# EAGLE design EnsembleTwo (EAGLE 7.6.0)
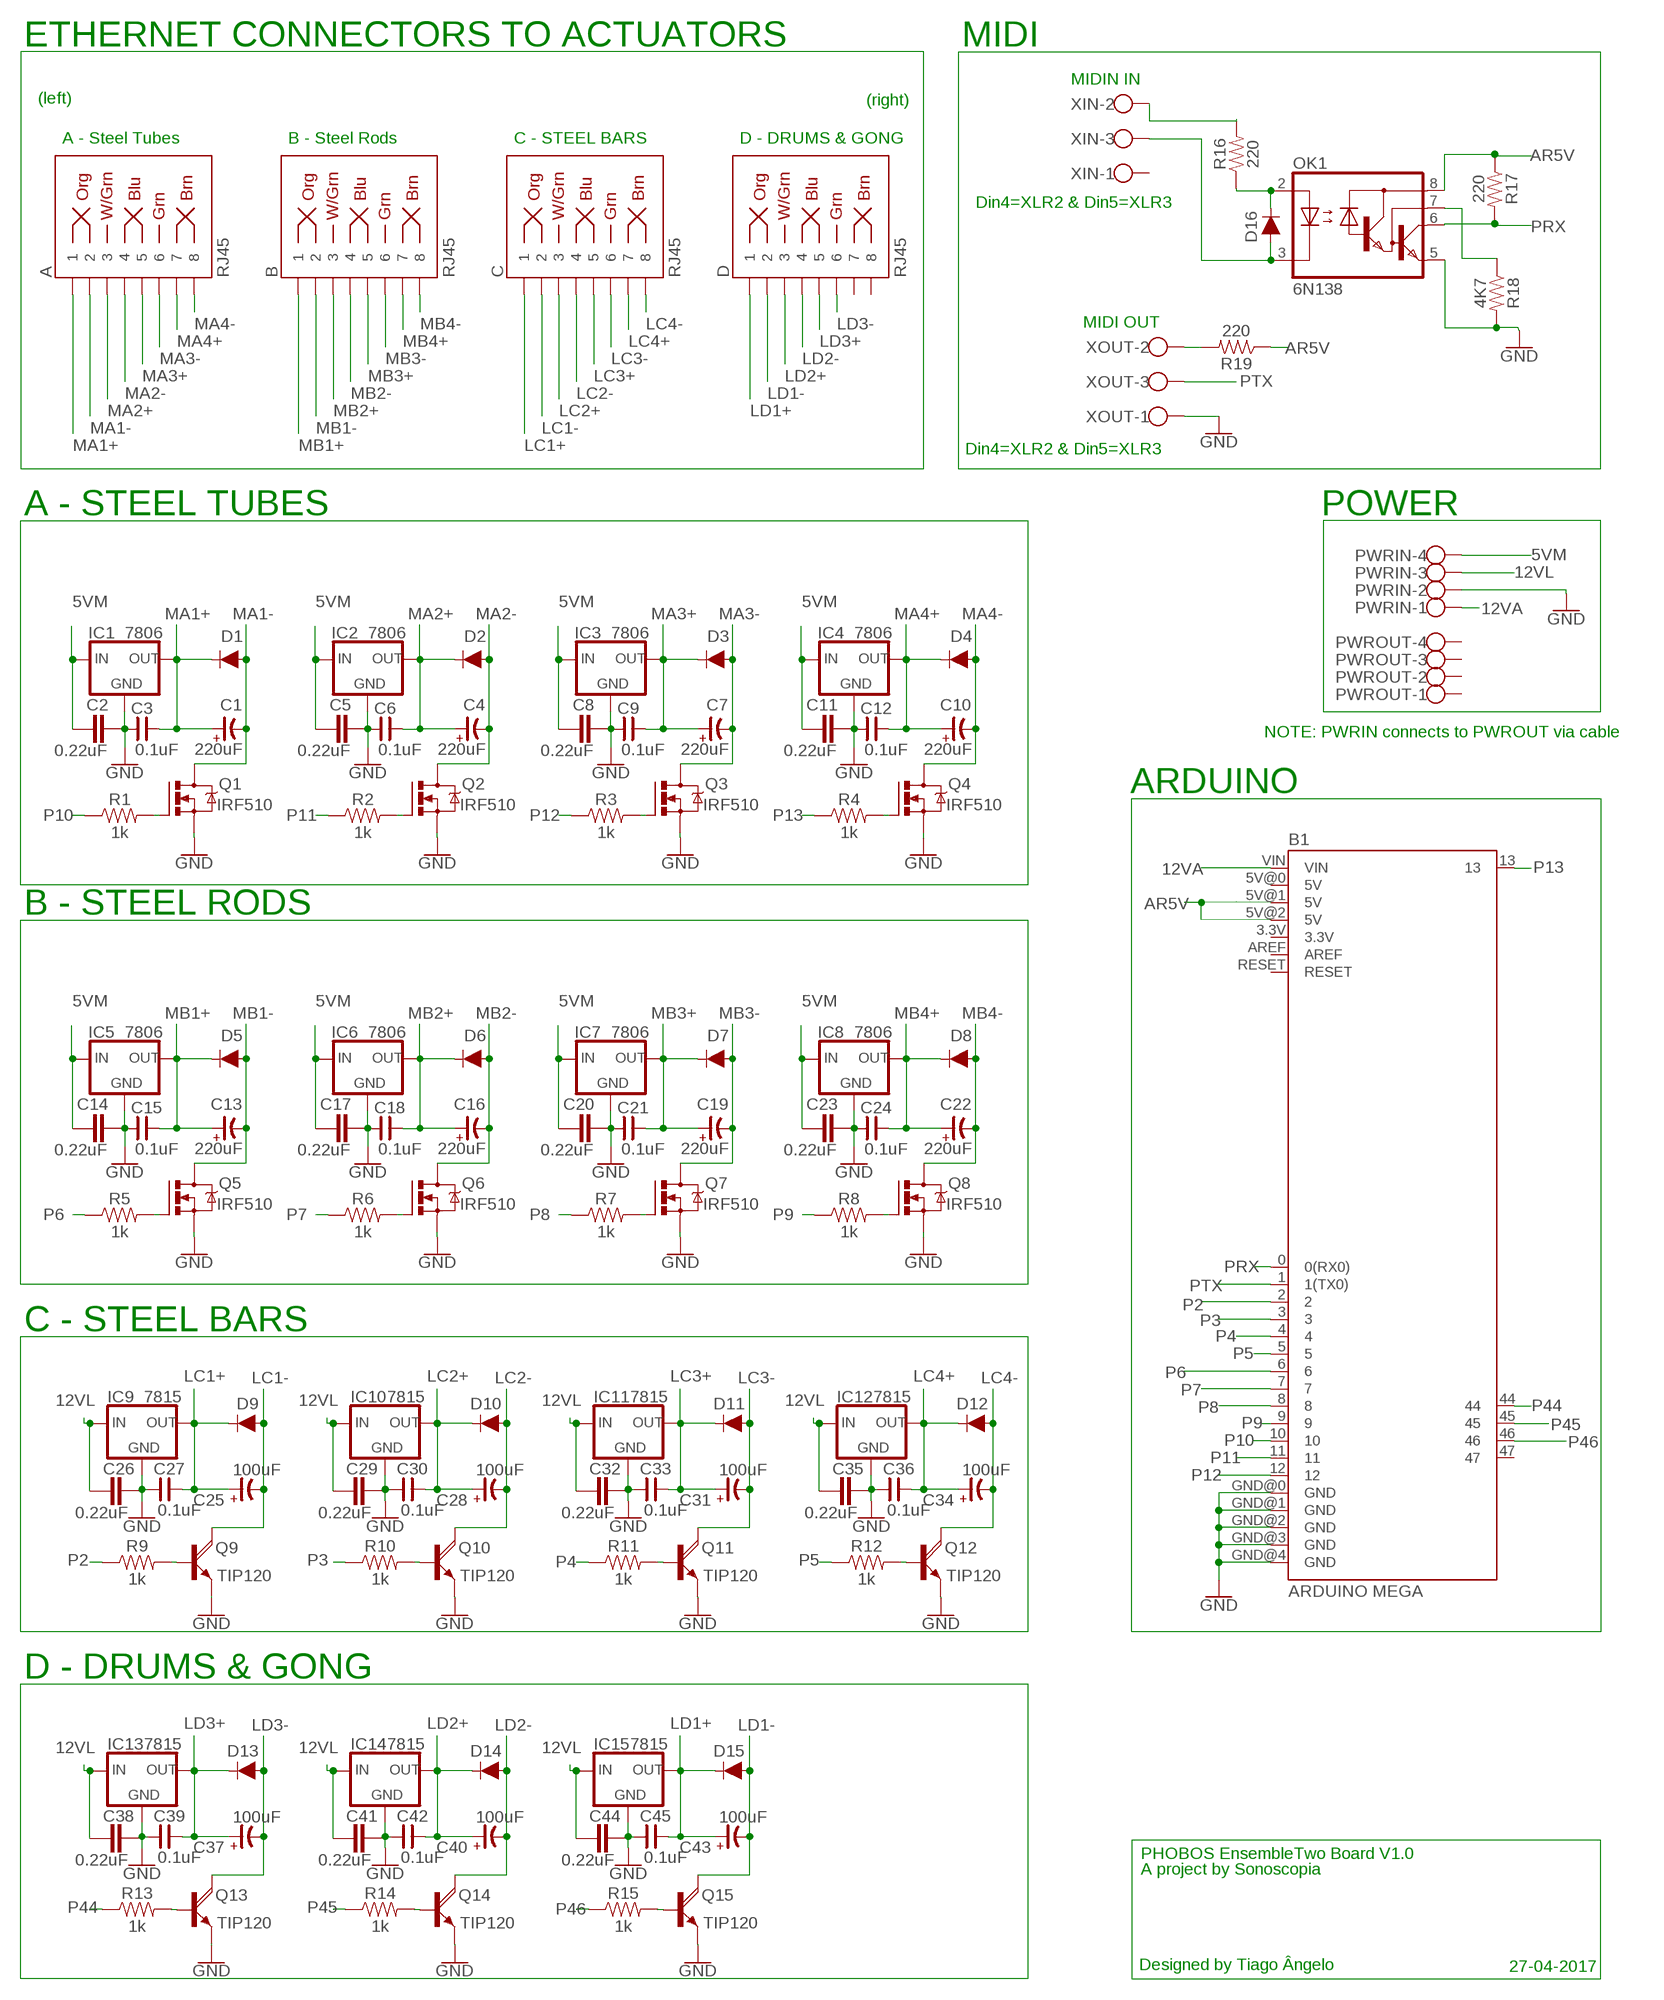
[diagram p0: schematic, sheet 1]

## Parts
A  RJ45  RJ45-8  [RJ45-8]
B  RJ45  RJ45-8  [RJ45-8]
B1  ARDUINO MEGA  ARDUINO_MEGA_R3FULL  [ARDUINO_MEGA]
C  RJ45  RJ45-8  [RJ45-8]
C1  220uF  CP-E-035X080  [E-035X080]
C2  0.22uF  C5/3  [C5B3]
C3  0.1uF  CNP-C025-050X025  [C025-050X025]
C4  220uF  CP-E-035X080  [E-035X080]
C5  0.22uF  C5/3  [C5B3]
C6  0.1uF  CNP-C025-050X025  [C025-050X025]
C7  220uF  CP-E-035X080  [E-035X080]
C8  0.22uF  C5/3  [C5B3]
C9  0.1uF  CNP-C025-050X025  [C025-050X025]
C10  220uF  CP-E-035X080  [E-035X080]
C11  0.22uF  C5/3  [C5B3]
C12  0.1uF  CNP-C025-050X025  [C025-050X025]
C13  220uF  CP-E-035X080  [E-035X080]
C14  0.22uF  C5/3  [C5B3]
C15  0.1uF  CNP-C025-050X025  [C025-050X025]
C16  220uF  CP-E-035X080  [E-035X080]
C17  0.22uF  C5/3  [C5B3]
C18  0.1uF  CNP-C025-050X025  [C025-050X025]
C19  220uF  CP-E-035X080  [E-035X080]
C20  0.22uF  C5/3  [C5B3]
C21  0.1uF  CNP-C025-050X025  [C025-050X025]
C22  220uF  CP-E-035X080  [E-035X080]
C23  0.22uF  C5/3  [C5B3]
C24  0.1uF  CNP-C025-050X025  [C025-050X025]
C25  100uF  CP-E-020X050  [E-020X050]
C26  0.22uF  C5/3  [C5B3]
C27  0.1uF  CNP-C025-050X025  [C025-050X025]
C28  100uF  CP-E-020X050  [E-020X050]
C29  0.22uF  C5/3  [C5B3]
C30  0.1uF  CNP-C025-050X025  [C025-050X025]
C31  100uF  CP-E-020X050  [E-020X050]
C32  0.22uF  C5/3  [C5B3]
C33  0.1uF  CNP-C025-050X025  [C025-050X025]
C34  100uF  CP-E-020X050  [E-020X050]
C35  0.22uF  C5/3  [C5B3]
C36  0.1uF  CNP-C025-050X025  [C025-050X025]
C37  100uF  CP-E-020X050  [E-020X050]
C38  0.22uF  C5/3  [C5B3]
C39  0.1uF  CNP-C025-050X025  [C025-050X025]
C40  100uF  CP-E-020X050  [E-020X050]
C41  0.22uF  C5/3  [C5B3]
C42  0.1uF  CNP-C025-050X025  [C025-050X025]
C43  100uF  CP-E-020X050  [E-020X050]
C44  0.22uF  C5/3  [C5B3]
C45  0.1uF  CNP-C025-050X025  [C025-050X025]
D  RJ45  RJ45-8  [RJ45-8]
D1  1A/50V/1.1V  DIODE-KIT2  [DIODE-1N4001-KIT]
D2  1A/50V/1.1V  DIODE-KIT2  [DIODE-1N4001-KIT]
D3  1A/50V/1.1V  DIODE-KIT2  [DIODE-1N4001-KIT]
D4  1A/50V/1.1V  DIODE-KIT2  [DIODE-1N4001-KIT]
D5  1A/50V/1.1V  DIODE-KIT2  [DIODE-1N4001-KIT]
D6  1A/50V/1.1V  DIODE-KIT2  [DIODE-1N4001-KIT]
D7  1A/50V/1.1V  DIODE-KIT2  [DIODE-1N4001-KIT]
D8  1A/50V/1.1V  DIODE-KIT2  [DIODE-1N4001-KIT]
D9  1A/50V/1.1V  DIODE-KIT2  [DIODE-1N4001-KIT]
D10  1A/50V/1.1V  DIODE-KIT2  [DIODE-1N4001-KIT]
D11  1A/50V/1.1V  DIODE-KIT2  [DIODE-1N4001-KIT]
D12  1A/50V/1.1V  DIODE-KIT2  [DIODE-1N4001-KIT]
D13  1A/50V/1.1V  DIODE-KIT2  [DIODE-1N4001-KIT]
D14  1A/50V/1.1V  DIODE-KIT2  [DIODE-1N4001-KIT]
D15  1A/50V/1.1V  DIODE-KIT2  [DIODE-1N4001-KIT]
D16  200mA/100V/1V  DIODE-1N4148  [DIODE-1N4148]
IC1  7806  78XXS  [78XXS]
IC2  7806  78XXS  [78XXS]
IC3  7806  78XXS  [78XXS]
IC4  7806  78XXS  [78XXS]
IC5  7806  78XXS  [78XXS]
IC6  7806  78XXS  [78XXS]
IC7  7806  78XXS  [78XXS]
IC8  7806  78XXS  [78XXS]
IC9  7815  78XXS  [78XXS]
IC10  7815  78XXS  [78XXS]
IC11  7815  78XXS  [78XXS]
IC12  7815  78XXS  [78XXS]
IC13  7815  78XXS  [78XXS]
IC14  7815  78XXS  [78XXS]
IC15  7815  78XXS  [78XXS]
OK1  6N138  [DIL08]
PWRIN  W237-4  [W237-4]
PWROUT  W237-4  [W237-4]
Q1  IRF510  IRF520  [TO220BV]
Q2  IRF510  IRF520  [TO220BV]
Q3  IRF510  IRF520  [TO220BV]
Q4  IRF510  IRF520  [TO220BV]
Q5  IRF510  IRF520  [TO220BV]
Q6  IRF510  IRF520  [TO220BV]
Q7  IRF510  IRF520  [TO220BV]
Q8  IRF510  IRF520  [TO220BV]
Q9  TIP120  TIP120V  [TO220AV]
Q10  TIP120  TIP120V  [TO220AV]
Q11  TIP120  TIP120V  [TO220AV]
Q12  TIP120  TIP120V  [TO220AV]
Q13  TIP120  TIP120V  [TO220AV]
Q14  TIP120  TIP120V  [TO220AV]
Q15  TIP120  TIP120V  [TO220AV]
R1  1k  1KOHM-VERT-1/4W-1%  [AXIAL-0.1]
R2  1k  1KOHM-VERT-1/4W-1%  [AXIAL-0.1]
R3  1k  1KOHM-VERT-1/4W-1%  [AXIAL-0.1]
R4  1k  1KOHM-VERT-1/4W-1%  [AXIAL-0.1]
R5  1k  1KOHM-VERT-1/4W-1%  [AXIAL-0.1]
R6  1k  1KOHM-VERT-1/4W-1%  [AXIAL-0.1]
R7  1k  1KOHM-VERT-1/4W-1%  [AXIAL-0.1]
R8  1k  1KOHM-VERT-1/4W-1%  [AXIAL-0.1]
R9  1k  1KOHM-VERT-1/4W-1%  [AXIAL-0.1]
R10  1k  1KOHM-VERT-1/4W-1%  [AXIAL-0.1]
R11  1k  1KOHM-VERT-1/4W-1%  [AXIAL-0.1]
R12  1k  1KOHM-VERT-1/4W-1%  [AXIAL-0.1]
R13  1k  1KOHM-VERT-1/4W-1%  [AXIAL-0.1]
R14  1k  1KOHM-VERT-1/4W-1%  [AXIAL-0.1]
R15  1k  1KOHM-VERT-1/4W-1%  [AXIAL-0.1]
R16  220  1KOHM-HORIZ-1/4W-5%  [AXIAL-0.3]
R17  220  1KOHM-HORIZ-1/4W-5%  [AXIAL-0.3]
R18  4K7  1KOHM-HORIZ-1/4W-5%  [AXIAL-0.3]
R19  220  1KOHM-HORIZ-1/4W-5%  [AXIAL-0.3]
XIN  W237-103  [W237-103]
XOUT  W237-103  [W237-103]

## Nets
5VM [5VM]: C2.1 C5.1 C8.1 C11.1 C14.1 C17.1 C20.1 C23.1 IC1.IN IC2.IN IC3.IN IC4.IN IC5.IN IC6.IN IC7.IN IC8.IN PWRIN.4
12VA [12VA]: B1.VIN PWRIN.1
12VL [12VL]: C26.1 C29.1 C32.1 C35.1 C38.1 C41.1 C44.1 IC9.IN IC10.IN IC11.IN IC12.IN IC13.IN IC14.IN IC15.IN PWRIN.3
AR5V: B1.5V@1(5V) B1.5V@2(5V) OK1.8(VCC) R17.P$1 R19.P$1
GND [GND]: B1.GND@0(GND) B1.GND@1(GND) B1.GND@2(GND) B1.GND@3(GND) B1.GND@4(GND) C2.2 C3.1 C5.2 C6.1 C8.2 C9.1 C11.2 C12.1 C14.2 C15.1 C17.2 C18.1 C20.2 C21.1 C23.2 C24.1 C26.2 C27.1 C29.2 C30.1 C32.2 C33.1 C35.2 C36.1 C38.2 C39.1 C41.2 C42.1 C44.2 C45.1 IC1.GND IC2.GND IC3.GND IC4.GND IC5.GND IC6.GND IC7.GND IC8.GND IC9.GND IC10.GND IC11.GND IC12.GND IC13.GND IC14.GND IC15.GND OK1.5(GND) PWRIN.2 Q1.S Q2.S Q3.S Q4.S Q5.S Q6.S Q7.S Q8.S Q9.E Q10.E Q11.E Q12.E Q13.E Q14.E Q15.E R18.P$2 XOUT.1
LC1+: C25.+ C27.2 C.1 D9.C IC9.OUT
LC1-: C25.- C.2 D9.A Q9.C
LC2+: C28.+ C30.2 C.3 D10.C IC10.OUT
LC2-: C28.- C.4 D10.A Q10.C
LC3+: C31.+ C33.2 C.5 D11.C IC11.OUT
LC3-: C31.- C.6 D11.A Q11.C
LC4+: C34.+ C36.2 C.7 D12.C IC12.OUT
LC4-: C34.- C.8 D12.A Q12.C
LD1+: C43.+ C45.2 D15.C D.1 IC15.OUT
LD1-: C43.- D15.A D.2 Q15.C
LD2+: C40.+ C42.2 D14.C D.3 IC14.OUT
LD2-: C40.- D14.A D.4 Q14.C
LD3+: C37.+ C39.2 D13.C D.5 IC13.OUT
LD3-: C37.- D13.A D.6 Q13.C
MA1+: A.1 C1.+ C3.2 D1.C IC1.OUT
MA1-: A.2 C1.- D1.A Q1.D
MA2+: A.3 C4.+ C6.2 D2.C IC2.OUT
MA2-: A.4 C4.- D2.A Q2.D
MA3+: A.5 C7.+ C9.2 D3.C IC3.OUT
MA3-: A.6 C7.- D3.A Q3.D
MA4+: A.7 C10.+ C12.2 D4.C IC4.OUT
MA4-: A.8 C10.- D4.A Q4.D
MB1+: B.1 C13.+ C15.2 D5.C IC5.OUT
MB1-: B.2 C13.- D5.A Q5.D
MB2+: B.3 C16.+ C18.2 D6.C IC6.OUT
MB2-: B.4 C16.- D6.A Q6.D
MB3+: B.5 C19.+ C21.2 D7.C IC7.OUT
MB3-: B.6 C19.- D7.A Q7.D
MB4+: B.7 C22.+ C24.2 D8.C IC8.OUT
MB4-: B.8 C22.- D8.A Q8.D
N$1: Q1.G R1.P$2
N$2: R19.P$2 XOUT.2
N$3: Q2.G R2.P$2
N$4: Q10.B R10.P$2
N$5: Q11.B R11.P$2
N$9: Q9.B R9.P$2
N$14: Q3.G R3.P$2
N$15: Q4.G R4.P$2
N$16: Q5.G R5.P$2
N$18: Q6.G R6.P$2
N$19: Q7.G R7.P$2
N$20: Q8.G R8.P$2
N$21: Q12.B R12.P$2
N$22: Q13.B R13.P$2
N$24: Q14.B R14.P$2
N$25: D16.A OK1.3(C) XIN.3
N$26: D16.C OK1.2(A) R16.P$1
N$27: R16.P$2 XIN.2
N$28: Q15.B R15.P$2
N$29: OK1.7(VB) R18.P$1
P2: B1.2 R9.P$1
P3: B1.3 R10.P$1
P4: B1.4 R11.P$1
P5: B1.5 R12.P$1
P6: B1.6 R5.P$1
P7: B1.7 R6.P$1
P8: B1.8 R7.P$1
P9: B1.9 R8.P$1
P10: B1.10 R1.P$1
P11: B1.11 R2.P$1
P12: B1.12 R3.P$1
P13: B1.13 R4.P$1
P44: B1.44 R13.P$1
P45: B1.45 R14.P$1
P46: B1.46 R15.P$1
PRX: B1.0(0(RX0)) OK1.6(VO) R17.P$2
PTX: B1.1(1(TX0)) XOUT.3
Unconnected: B1.3.3V B1.5V@0(5V) B1.47 B1.AREF B1.RESET D.7 D.8 PWROUT.1 PWROUT.2 PWROUT.3 PWROUT.4 XIN.1

## Notes on the sheet
- ETHERNET CONNECTORS TO ACTUATORS | MIDI
- MIDIN IN
- (left) | (right)
- A - Steel Tubes | B - Steel Rods | C - STEEL BARS | D - DRUMS & GONG
- Din4=XLR2 & Din5=XLR3
- MIDI OUT
- Din4=XLR2 & Din5=XLR3
- A - STEEL TUBES | POWER
- NOTE: PWRIN connects to PWROUT via cable
- ARDUINO
- B - STEEL RODS
- C - STEEL BARS
- D - DRUMS & GONG
- PHOBOS EnsembleTwo Board V1.0
- A project by Sonoscopia
- Designed by Tiago Ângelo | 27-04-2017

## Library data of the parts
A B C D = SparkFun-Connectors:RJ45-8: RJ45 Jack - 8 pin Simple RJ45, 8-pin connection. Commonly used for Cat5, Cat5e, and Cat6 Ethernet cables. Here is the connector we sell at SparkFun: RJ45 8-Pin Connector <https://www.sparkfun.com/products/643> (PRT-00643) Datasheet <https://cdn.sparkfun.com/datasheets/Prototyping/04908.pdf> It is used on this SparkFun product: SparkFun RJ45 Breakout <https://www.sparkfun.com/products/716> (BOB-00716) Note, you may also be interested in the "MAGJACK" version of this. It is basically a RJ45 connector, but also has some status LEDs built into the connector housing. You can check that out in this library at the device named "MAGJACK.dev" and see these products online: RJ45 Ethernet MagJack-Compatible <https://www.sparkfun.com/products/8534> (PRT-08534) SparkFun RJ45 MagJack Breakout <https://www.sparkfun.com/products/13021> (BOB-13021); PROD_ID: CONN-08506; SF_ID: PRT-00643
B1 = PHOBOS-Boards:ARDUINO_MEGA_R3: Arduino Mega R3 ATmega2560 R3 compatible footprint. SparkFun Products: Arduino Mega 2560 R3 <https://www.sparkfun.com/products/11061>
C1 C4 C7 C10 C13 C16 C19 C22 C25 C28 C31 C34 C37 C40 C43 = cap-master:CP-: POLARIZED CAP
C2 C5 C8 C11 C14 C17 C20 C23 C26 C29 C32 C35 C38 C41 C44 = capacitor-wima:C: CAPACITOR naming: grid - package width
C3 C6 C9 C12 C15 C18 C21 C24 C27 C30 C33 C36 C39 C42 C45 = cap-master:CNP-: NON-POLARIZED CAP
D1-D15 = SparkFun-DiscreteSemi:DIODE: Diode These are standard reverse protection diodes and small signal diodes. SparkFun Products: SparkFun SparkPunk Sound Kit <https://www.sparkfun.com/products/11177> SparkFun ESP8266 Thing <https://www.sparkfun.com/products/13231>; PROD_ID: DIO-09176
D16 = SparkFun-DiscreteSemi:DIODE: Diode These are standard reverse protection diodes and small signal diodes. SparkFun Products: SparkFun SparkPunk Sound Kit <https://www.sparkfun.com/products/11177> SparkFun ESP8266 Thing <https://www.sparkfun.com/products/13231>; PROD_ID: DIO-08378
IC1-IC15 = v-reg:78XXS: VOLTAGE REGULATOR
OK1 = optocoupler:6N138: MOTOROLA OPTO COUPLER; MF: VISHAY/TELEFUNKEN; MPN: 6N138; OC_FARNELL: 9860150; OC_NEWARK: 35K5294
PWRIN PWROUT = con-wago-500:W237-4: WAGO SCREW CLAMP; OC_FARNELL: unknown; OC_NEWARK: unknown
Q1-Q8 = transistor-power:IRF520: HEXFET Power MOSFET
Q9-Q15 = rocketfarm:TIP120: NPN DARLINGTON TRANSISTOR
R1-R15 = SparkFun-Resistors:1KOHM: 1kΩ resistor A resistor is a passive two-terminal electrical component that implements electrical resistance as a circuit element. Resistors act to reduce current flow, and, at the same time, act to lower voltage levels within circuits. - Wikipedia; PROD_ID: RES-12182
R16-R19 = SparkFun-Resistors:1KOHM: 1kΩ resistor A resistor is a passive two-terminal electrical component that implements electrical resistance as a circuit element. Resistors act to reduce current flow, and, at the same time, act to lower voltage levels within circuits. - Wikipedia; PROD_ID: RES-08380; VALUE: 1k
XIN XOUT = con-wago-500:W237-103: WAGO SCREW CLAMP; MPN: 237-103; OC_FARNELL: unknown; OC_NEWARK: 18M7116

## Net classes
0 default: width 0.508 mm, drill 0.508 mm, clearance 0.406 mm
1 GND: width 1.016 mm, drill 0.508 mm, clearance 0.508 mm
2 5VM: width 1.016 mm, drill 0.508 mm, clearance 0.508 mm
3 12VL: width 0.61 mm, drill 0.508 mm, clearance 0.508 mm
4 12VA: width 0.508 mm, drill 0.508 mm, clearance 0.508 mm
5 AR5V: width 0.406 mm, drill 0.508 mm, clearance 0.508 mm
6 PTX: width 0.406 mm, drill 0.508 mm, clearance 0.508 mm
7 PRX: width 0.406 mm, drill 0.508 mm, clearance 0.508 mm

## Board
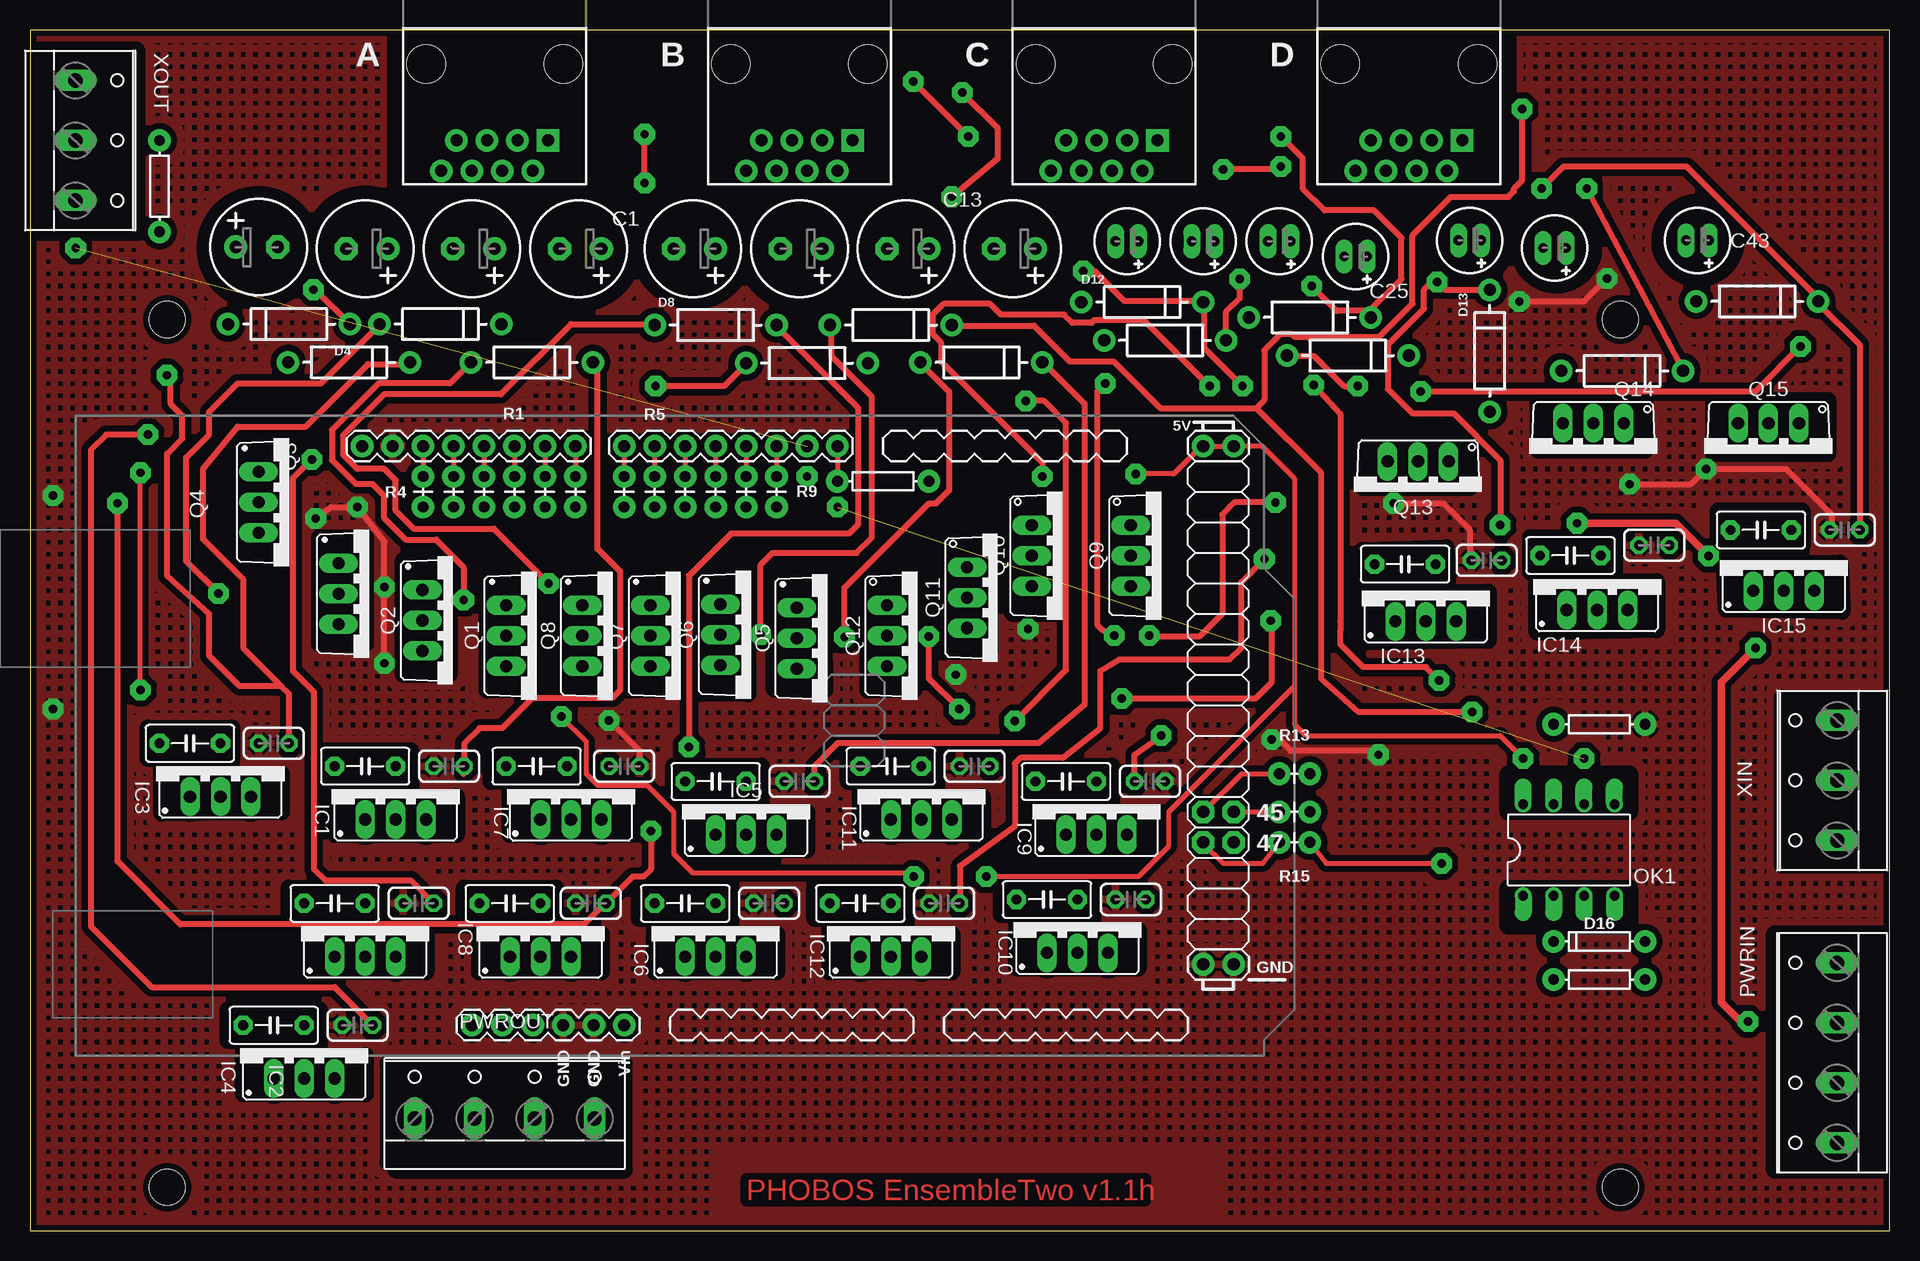
[diagram p1: board, top side]
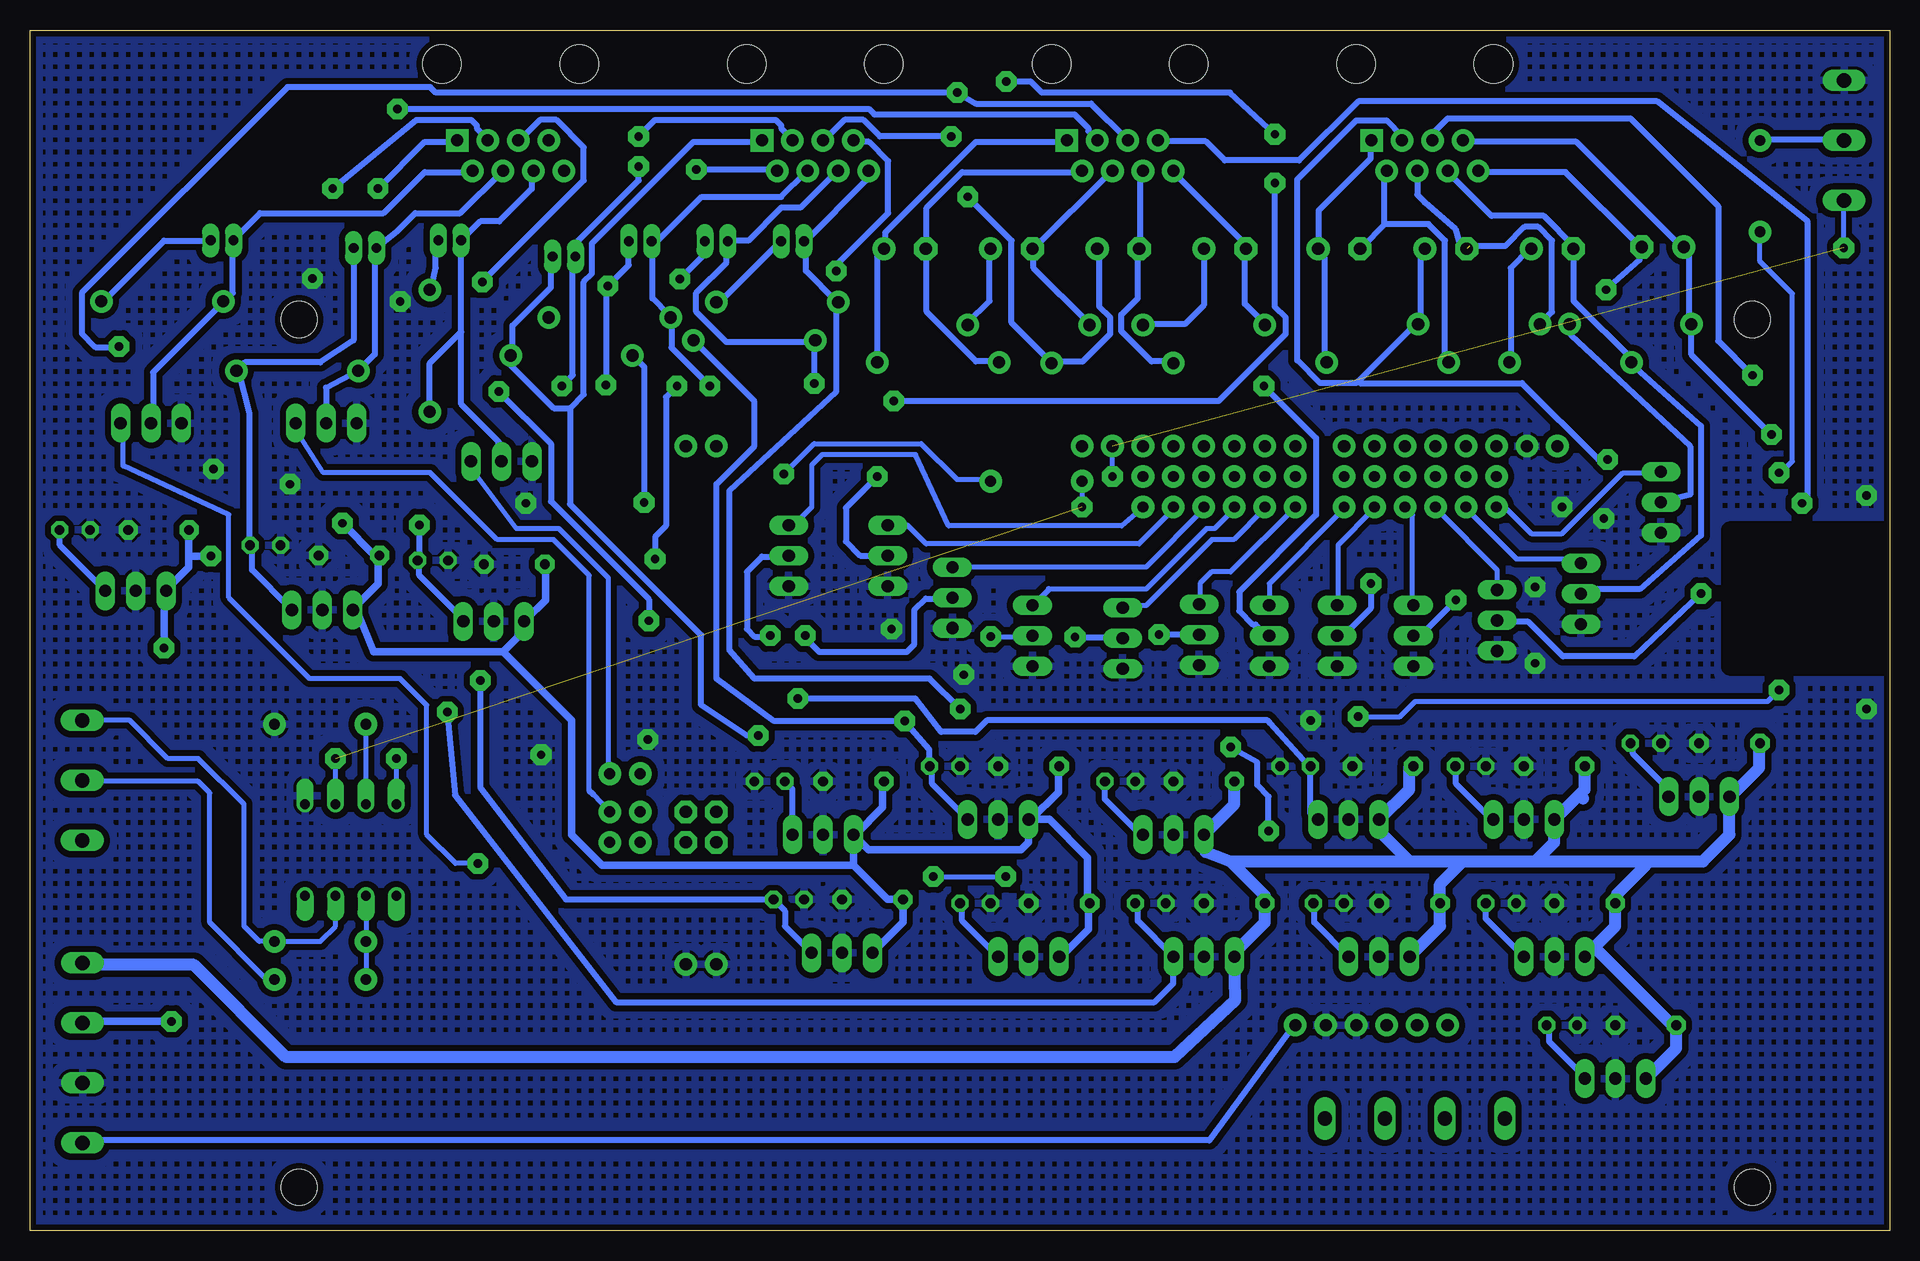
[diagram p2: board, bottom side, seen from below]

Size 155 x 100.08 mm. Coordinates in mm from the lower left corner, seen from the top.
Outline: 0,0 155,0 155,100.08 0,100.08 0,0
Copper layers (1*16): Top 0.035mm / dielectric 1.5mm / Bottom 0.035mm
Design rules "Dek": minimum track width 12mil, minimum drill 36mil, track to track 12mil, track to pad 12mil, pad to pad 12mil, via to via 12mil, smd to smd 0mil, copper to edge 10mil, drill to drill 12mil, minimum pad ring 12mil, minimum via ring 20mil, stop-mask expansion 4mil, vias tented up to drill 25mil, thermal gap 10mil
Holes 3 mm at 132.55,75.95 132.55,3.65 11.45,3.65 11.45,75.95
Holes 1.5 mm at 203.2,95.25
tRestrict: area 30.5,87 to 47,108; area 55.9,87 to 72.4,108; area 81.3,87 to 97.8,108; area 106.7,87 to 123.2,108; area 146.1,30.5 to 154.9,44.5; area 145.4,5.1 to 154.9,24.8; area 29.8,5.1 to 49.5,14; area -0.6,83.2 to 8.9,98.4; area 16.5,15.9 to 24.1,18.4; area 17.8,11.4 to 27.9,14.6; area 21.6,26 to 29.2,28.6; area 22.9,21.6 to 33,24.8; 72 more areas
bRestrict: area -2.5,47 to 13.3,58.4
vRestrict: area 71.1,64.1 to 91.4,66.7; area 96.5,36.2 to 101.6,64.1; area 96.5,23.5 to 101.6,31.1; area 53.3,15.9 to 73.7,18.4; area 76.2,15.9 to 96.5,18.4; area -2.5,47 to 13.3,58.4; area 123.2,29.2 to 133.3,34.3; area 141,76.2 to 147.3,78.7; area 103.5,74.9 to 109.9,77.5; area 106.7,71.8 to 113,74.3; area 91.4,73 to 97.8,75.6; area 89.5,76.2 to 95.9,78.7; 10 more areas

### Footprints (pad centres in the part's own frame; a part is rotated, then mirrored left to right if it is on the bottom)
RJ45-8 = drill 1 pad 1.88 square: 1 -4.445,6.35 | drill 1 pad 1.88: 2 -3.175,8.89; 3 -1.905,6.35; 4 -0.635,8.89; 5 0.635,6.35; 6 1.905,8.89; 7 3.175,6.35; 8 4.445,8.89 | hole 3.2: -5.715,0; 5.715,0
ARDUINO_MEGA = drill 1.016 pad 1.88: 0 13.97,24.13; 1 11.43,24.13; 2 8.89,24.13; 3 6.35,24.13; 3.3V -13.97,-24.13; 4 3.81,24.13; 5 1.27,24.13; 5V@0 -11.43,-24.13; 5V@1 44.45,24.13; 5V@2 46.99,24.13; 6 -1.27,24.13; 7 -3.81,24.13; 8 -7.874,24.13; 9 -10.414,24.13; 10 -12.954,24.13; 11 -15.494,24.13; 12 -18.034,24.13; 13 -20.574,24.13; AREF -25.654,24.13; GND@0 -8.89,-24.13; GND@1 -6.35,-24.13; GND@2 44.45,-19.05; GND@3 46.99,-19.05; GND@4 -23.114,24.13; RESET -16.51,-24.13; VIN -3.81,-24.13 | drill 1.016 pad 1.88 octagon: 44 44.45,-6.35; 45 46.99,-6.35; 46 44.45,-8.89; 47 46.99,-8.89
E-035X080 = drill 1.016 pad 1.93: + -1.905,0 | drill 1.016 pad 1.93 octagon: - 1.587,0
C5B3 = drill 0.813 pad 1.6 octagon: 1 -2.54,0; 2 2.54,0
C025-050X025 = drill 0.813 pad 1.422 octagon: 1 -1.27,0; 2 1.27,0
E-020X050 = drill 0.813 long: + -0.953,0; - 0.953,0
DIODE-1N4001-KIT = drill 1.016 pad 1.88: A -5.08,0; C 5.08,0
DIODE-1N4148 = drill 0.9 pad 1.88: A -3.81,0; C 3.81,0
78XXS = drill 1.016 long: GND 0,-2.54; IN -2.54,-2.54; OUT 2.54,-2.54
DIL08 = drill 0.813 offset: 1 -3.81,-3.81; 2 -1.27,-3.81; 3 1.27,-3.81; 4 3.81,-3.81; 5 3.81,3.81; 6 1.27,3.81; 7 -1.27,3.81; 8 -3.81,3.81
W237-4 = drill 1.194 long: 1 -7.5,-1.27; 2 -2.5,-1.27; 3 2.5,-1.27; 4 7.5,-1.27
TO220BV = drill 1.016 long: D 0,-2.54; G -2.54,-2.54; S 2.54,-2.54
TO220AV = drill 1.016 long: B -2.54,-2.54; C 0,-2.54; E 2.54,-2.54
AXIAL-0.1 = drill 0.9 pad 1.88: P$1 -1.27,0; P$2 1.27,0
AXIAL-0.3 = drill 0.9 pad 1.88: P$1 -3.81,0; P$2 3.81,0
W237-103 = drill 1.194 long: 1 -5,-1.29; 2 0,-1.29; 3 5,-1.29

### Placement (x,y rotation side)
A  38.73,97.23 180 top
B  64.13,97.23 180 top
B1  53.34,41.27 0 top
C  89.53,97.23 180 top
C1  45.72,81.84 180 top
C2  27.94,38.73 0 top
C3  34.92,38.73 0 top
C4  36.83,81.84 180 top
C5  25.4,27.3 0 top
C6  32.38,27.3 0 top
C7  27.94,81.84 180 top
C8  13.34,40.64 0 top
C9  20.32,40.64 0 top
C10  19.05,81.99 0 top
C11  20.32,17.14 0 top
C12  27.3,17.14 0 top
C13  81.91,81.84 180 top
C14  57.15,37.47 0 top
C15  64.13,37.47 0 top
C16  73.03,81.84 180 top
C17  54.61,27.3 0 top
C18  61.6,27.3 0 top
C19  64.13,81.84 180 top
C20  42.23,38.73 0 top
C21  49.53,38.73 180 top
C22  55.24,81.84 180 top
C23  40.01,27.3 0 top
C24  46.75,27.3 0 top
C25  110.49,81.2 180 top
C26  86.36,37.47 0 top
C27  93.34,37.47 180 top
C28  104.14,82.47 180 top
C29  84.77,27.62 0 top
C30  91.76,27.62 0 top
C31  97.79,82.47 180 top
C32  71.75,38.73 0 top
C33  78.74,38.73 0 top
C34  91.44,82.47 180 top
C35  69.22,27.3 0 top
C36  76.2,27.3 0 top
C37  120.02,82.55 180 top
C38  114.62,55.56 0 top
C39  121.42,55.88 0 top
C40  127.08,81.92 180 top
C41  128.41,56.29 0 top
C42  135.39,57.15 0 top
C43  138.99,82.55 180 top
C44  144.28,58.42 0 top
C45  151.27,58.42 0 top
D  114.94,97.23 180 top
D1  41.84,72.39 0 top
D2  34.21,75.56 0 top
D3  26.59,72.39 0 top
D4  21.59,75.56 180 top
D5  79.3,72.39 0 top
D6  71.75,75.49 0 top
D7  64.77,72.31 0 top
D8  57.15,75.49 0 top
D9  109.86,72.95 0 top
D10  106.68,76.12 0 top
D11  94.62,74.22 0 top
D12  92.71,77.39 0 top
D13  121.68,73.34 90 top
D14  132.72,71.68 0 top
D15  143.97,77.47 0 top
D16  130.81,24.13 180 top
IC1  30.48,36.83 0 top
IC2  27.94,25.4 0 top
IC3  15.88,38.73 0 top
IC4  22.86,15.24 0 top
IC5  59.69,35.56 0 top
IC6  57.15,25.4 0 top
IC7  45.09,36.83 0 top
IC8  42.55,25.4 0 top
IC9  88.9,35.56 0 top
IC10  87.31,25.72 0 top
IC11  74.29,36.83 0 top
IC12  71.75,25.4 0 top
IC13  116.34,53.34 0 top
IC14  130.63,54.29 0 top
IC15  146.19,55.88 0 top
OK1  128.27,31.75 0 top
PWRIN  149.35,14.84 90 top
PWROUT  39.57,10.65 0 top
Q1  42.23,49.6 270 top
Q2  35.24,50.88 270 top
Q3  28.26,53.1 270 top
Q4  21.59,60.72 270 top
Q5  66.46,49.4 270 top
Q6  60.08,49.68 270 top
Q7  54.24,49.6 270 top
Q8  48.58,49.6 270 top
Q9  94.3,56.27 270 top
Q10  86.04,56.27 270 top
Q11  80.65,52.78 270 top
Q12  73.98,49.6 270 top
Q13  115.71,61.59 180 top
Q14  130.31,64.77 180 top
Q15  144.92,64.77 180 top
R1  40.39,61.59 270 top
R2  37.85,61.59 270 top
R3  35.31,61.59 270 top
R4  32.77,61.59 270 top
R5  52.07,61.59 270 top
R6  49.53,61.59 270 top
R7  45.47,61.59 270 top
R8  42.93,61.59 270 top
R9  62.23,61.59 270 top
R10  59.69,61.59 270 top
R11  57.15,61.59 270 top
R12  54.61,61.59 270 top
R13  105.41,38.1 0 top
R14  105.41,34.92 0 top
R15  105.41,32.38 0 top
R16  130.81,20.95 0 top
R17  71.12,62.48 180 top
R18  130.81,42.23 0 top
R19  10.79,87.07 90 top
XIN  149.35,37.54 90 top
XOUT  5.08,90.88 270 top

### Tracks (layer width: path | path; a pad name or v marks a point on that pad's centre or on a via)
5VM
  Bottom 1.016: IC7.IN 40.03,36.8 40.03,38.63 C20.1 | C8.1 10.87,40.44 10.87,38.61 13.16,36.32 IC3.IN 13.49,35.72 13.49,35.56 | C2.1 25.4,36.8 25.86,36.34 | 25.86,36.34 27.91,34.29 IC1.IN | PWRIN.4 150.44,22.17 141.33,22.17 133.63,14.48 59.59,14.48 54.52,19.23 IC6.IN 54.45,23.34 52.07,25.72 C17.1 52.07,27.94 54.93,30.8 | 13.49,35.08 13.49,35.56 | 25.56,36.04 25.86,36.34 | IC4.IN 17.78,15.24 C11.1 18.26,17.3 24.61,23.65 | IC2.IN 24.61,23.65 | 24.61,23.65 22.86,25.4 C5.1 22.7,27.78 22.7,28.1 20.32,30.48 20.32,30.8 | IC8.IN 37.46,25.4 C23.1 37.46,28.89 35.56,30.8 | 42.39,33.81 IC7.IN | C14.1 54.61,35.56 IC5.IN 56.99,32.54 56.99,31.59 54.93,30.8 | IC7.IN 42.55,33.34 40.01,30.8 | 28.1,33.18 28.1,33.81 IC1.IN | 54.93,30.8 40.01,30.8 | 40.01,30.8 35.56,30.8 | 35.56,30.8 29.53,30.8 | 29.53,30.8 27.94,32.38 IC1.IN | 29.53,30.8 20.32,30.8 | 20.32,30.8 15.56,30.8 13.34,33.02 13.34,35.4 13.49,35.56
12VA
  Bottom 0.508: PWRIN.1 150.44,7.54 56.69,7.54 49.63,17.14 B1.VIN
12VL  (via drill 0.7)
  Top 0.61: v139.93,56.24 137.19,58.98 v128.96,58.98 | v143.83,48.58 140.97,45.72 140.97,19.05 142.56,17.46 v143.19,17.46
  Bottom 0.61: 141.76,56.24 141.76,55.32 143.59,53.49 IC15.IN 143.83,53.16 v143.83,48.58 | 141.76,56.24 141.76,58.29 C44.1 | 150.67,17.37 PWRIN.3 150.62,17.46 v143.19,17.46 | C38.1 112.04,55.78 112.04,52.58 113.64,50.98 IC13.IN 114.3,50.8 114.3,49.53 115.57,48.26 | IC12.IN 69.06,22.86 66.78,25.15 66.78,27.2 C35.1 66.83,27.46 66.83,31.11 70.01,34.29 IC11.IN | C32.1 69.29,38.63 69.29,36.58 71.58,34.29 IC11.IN | C26.1 83.92,37.36 83.92,35.31 86.21,33.02 IC9.IN | v139.93,56.24 141.76,56.24 | v128.96,58.98 126.21,56.24 C41.1 125.98,56.24 125.98,53.95 128.04,51.89 IC14.IN 127.64,51.44 126.37,48.26 115.57,48.26 | IC10.IN 82.23,25.72 C29.1 83.5,27.62 86.36,30.48 | 86.36,30.48 IC9.IN | IC11.IN 71.75,32.38 72.39,31.75 85.09,31.75 IC9.IN | 115.57,48.26 109.86,42.55 109.86,33.02 107.31,30.48 86.36,30.48
AR5V  (via drill 0.7)
  Top 0.406: v92.15,63.09 95.35,63.09 97.57,65.31 | 97.64,65.38 97.57,65.31 | v124.46,39.37 122.56,41.27 106.36,41.27 105.41,42.23 105.41,45.4 | 105.41,45.4 105.41,62.71 102.71,65.41 B1.5V@2 B1.5V@1 97.63,65.25 97.57,65.31 | v79.69,29.53 92.39,29.53 94.93,32.07 94.93,34.92 105.41,45.4 | v44.29,42.86 46.35,40.8 46.35,38.1 47.31,37.15 51.43,37.15 53.66,34.92 53.66,31.43 55.24,29.84 73.34,29.84 v73.66,29.53 | v9.21,45.09 v9.21,63.18
  Bottom 0.406: v92.15,63.09 89.64,65.61 80.72,65.61 77.75,62.64 75.01,62.64 R17.P$1 | v124.46,39.37 OK1.8 | R19.P$1 10.79,80.8 8.1,78.11 8.1,64.14 9.05,63.18 v9.21,63.18 | v44.29,42.86 40.8,42.86 39.53,44.13 10.16,44.13 v9.21,45.09 | v79.69,29.53 v73.66,29.53
GND  (via drill 0.7)
  Top 0.508: v113.67,60.64 117.79,60.64 120.02,58.42 120.02,56.02 C39.1 | v124.14,77.47 129.54,77.47 v131.44,79.38 | v133.35,62.23 138.43,62.23 v139.7,63.5 146.37,63.5 150.18,59.69 150.18,58.6 C45.1 | C21.1 50.8,40.01 v48.26,42.55 | v112.4,39.69 112.08,40.01 105.09,40.01 104.14,40.96 v103.5,40.96 | v23.81,59.37 25.08,60.33 v27.3,60.33 29.53,57.47 v29.53,53.66 v29.53,47.31
  other vias: 1.91,61.28 1.91,43.5 77.15,46.35 83.19,50.16
  pour Bottom (isolate 0.508, hatched): -5.08,104.14 160.02,104.14 160.02,0 -5.08,0
  pour Top (isolate 0.508, hatched): -3.81,102.87 157.48,102.87 157.48,0 -3.81,0
LC1+  (via drill 0.7)
  Top 0.508: C27.2 92.07,39.69 v94.3,41.27
  Bottom 0.508: C25.+ 111.58,81.15 111.58,78.64 114.78,75.44 114.78,73.15 D9.C 115.01,72.69 115.01,72.24 111.35,68.58 109.98,68.58 | 109.98,68.58 108.84,69.72 108.84,79.1 108.15,79.78 108.15,82.3 99.69,90.75 93.98,90.75 C.1 | 109.98,68.58 109.98,60.58 99.06,49.66 99.06,43.81 95.25,41.27 v94.3,41.27 | IC9.OUT 91.44,36.83 C27.2
LC1-  (via drill 0.7)
  Top 0.508: v110.67,70.41 109.53,70.41 107.01,72.92 104.95,72.92 D9.A | 93.98,49.61 v93.29,49.61 93.37,49.53 97.47,49.53 99.38,51.44 99.38,59.69 100.39,60.71 v103.81,60.71 | v99.47,88.47 104.04,88.47 v104.27,88.7
  Bottom 0.508: v110.67,70.41 109.75,71.32 109.75,81.15 C25.- 109.53,81.38 109.53,82.3 104.27,87.55 v104.27,88.7 | v103.81,60.71 103.81,72.01 104.72,72.92 D9.A | v99.47,88.47 92.84,88.47 C.2 | Q9.C 91.83,56.2 93.98,56.2 95.25,54.93 95.25,50.16 94.62,49.53 93.37,49.53 v93.29,49.61
LC2+  (via drill 0.7)
  Top 0.508: v104.27,91.21 106.1,89.38 106.1,86.87 107.93,85.04 112.04,85.04 114.33,82.75 114.33,79.32 111.58,76.58 D10.C 111.44,76.68 108.9,76.68 v106.84,78.74 | v107,70.48 107.47,70.01 109.22,68.1 109.22,50.8 109.22,50.01 109.22,48.9 111.12,46.99 116.36,46.99 v117.47,45.88
  Bottom 0.508: 89.9,23.18 IC10.OUT 92.07,25.4 92.07,26.67 C30.2 110.33,27.62 117.47,36.99 v117.47,45.88 | v104.27,91.21 102.9,92.58 92.84,92.58 92.38,92.13 92.38,91.9 91.47,90.98 C.3 | C28.+ 105.09,80.49 v106.84,78.74 107,78.58 v107,70.48
LC2-  (via drill 0.7)
  Top 0.508: v84.38,62.87 84.38,64.01 75.92,72.47 75.92,74.07 75.24,74.75 75.24,76.35 76.15,77.27 80.03,77.27 80.95,76.35 86.21,76.35 86.89,75.67 88.49,75.67 88.72,75.89 92.84,75.89 v98.32,70.41
  Bottom 0.508: v98.32,70.41 101.52,73.61 101.52,75.89 D10.A 101.75,76.35 103.12,77.72 103.12,82.3 C28.- 102.9,82.3 99.01,86.18 92.38,86.18 90.32,88.24 C.4 | v84.38,62.87 87,60.25 87,57.47 85.8,56.27 Q10.C
LC3+  (via drill 0.7)
  Top 0.508: v100.84,79.32 100.84,77.72 99.69,76.58 D11.C | v73.63,95.78 v78.21,91.21 | v51.23,87.33 v51.23,91.39 | 83.06,69.22 v83.01,69.16 84.51,69.16 86.36,67.31 86.36,46.75 v82.09,42.48
  Bottom 0.508: v100.84,79.32 98.78,81.38 98.78,82.3 C31.+ | IC11.OUT 79.81,37.26 79.81,38.63 C33.2 80.03,38.86 80.03,40.11 v82.09,42.48 92.96,42.48 97.79,46.04 97.79,62.23 94.62,65.41 94.62,69.14 D11.C 99.69,74.07 | v78.21,91.21 84.15,91.21 85.52,92.58 87.12,92.58 88.72,90.98 C.5 | v73.63,95.78 71.58,95.78 70.66,94.87 54.97,94.87 v51.23,91.39 | v51.23,87.33 51.23,77.04 50.32,76.12 50.32,74.75 55.9,69.16 v83.01,69.16
LC3-  (via drill 0.7)
  Top 0.508: v90.36,49.61 89.41,50.06 88.95,50.52 88.95,69.95 v89.64,70.64
  Bottom 0.508: C.6 87.81,88.24 90.78,85.27 92.38,85.27 95.12,82.53 96.72,82.53 C31.- 96.95,82.3 96.95,80.7 99.47,78.18 99.47,76.58 96.95,74.07 89.87,74.07 D11.A 89.64,74.07 v89.64,70.64 | v90.36,49.61 90.36,49.4 89.22,48.26 81.91,48.26 81.28,48.9 81.28,51.75 80.33,52.7 78.18,52.7 Q11.C
LC4+  (via drill 0.7)
  Top 0.508: v87.81,80.01 88.72,80.01 91.24,77.5 97.64,77.5 D12.C 97.87,77.27 97.87,73.61 v101.07,70.41 | C36.2 77.52,27.43 77.52,30.4 82.09,33.71 82.09,38.96 82.55,39.42 86.09,39.42 89.22,41.91 89.22,46.67 90.81,47.62 100.01,47.62 100.97,48.58 100.97,54.08 v102.9,56.01
  Bottom 0.508: C36.2 77.29,27.2 77.29,25.83 74.32,22.86 IC12.OUT | C34.+ 92.61,82.3 97.64,77.27 D12.C | v87.81,80.01 87.81,80.47 83.46,84.81 83.46,89.15 85.06,90.75 86.21,90.75 C.7 | v102.9,56.01 102.9,57.84 101.98,58.75 101.98,69.49 v101.07,70.41
LC4-  (via drill 0.7)
  Top 0.508: v77.47,43.5 74.93,46.04 v74.93,49.53
  Bottom 0.406: v74.93,49.53 71.51,49.53 Q12.C
  Bottom 0.508: C.8 85.29,88.24 85.29,87.55 90.32,82.53 C34.- 90.32,82.3 90.32,80.01 87.81,77.5 D12.A 87.81,77.27 87.81,69.95 96.71,61.68 96.71,48.45 94.62,46.04 80.01,46.04 v77.47,43.5
LD1+  (via drill 0.7)
  Top 0.508: v125.98,86.87 127.81,88.7 138.1,88.7 148.84,77.95 148.84,77.5 D15.C 149.07,77.27 152.5,73.84 152.5,58.52 C45.2
  Bottom 0.508: C45.2 152.5,58.29 152.5,57.15 148.84,53.49 IC15.OUT | C43.+ 140.16,82.53 143.81,82.53 148.84,77.5 D15.C | v125.98,86.87 122.1,90.75 119.58,90.75 D.1
LD1-
  Bottom 0.508: Q15.C 144.73,67.44 144.73,71.55 139.01,77.27 D15.A 138.79,77.5 138.1,78.18 138.1,82.53 C43.- 137.87,82.75 135.81,84.81 125.53,84.81 122.1,88.24 118.21,88.24 D.2
LD2+  (via drill 0.7)
  Top 0.508: v129.77,86.87 D14.C
  Bottom 0.508: IC14.OUT 133.3,51.89 136.5,55.09 136.5,57.15 C42.2 136.73,57.38 136.73,68.12 137.62,71.55 D14.C 137.09,72.39 130.81,72.39 128.03,74.22 C40.+ | v129.77,86.87 122.78,92.58 118.21,92.58 117.75,92.13 117.75,91.9 116.84,90.98 D.3
LD2-
  Bottom 0.508: Q14.C 130.33,67.44 130.33,70.28 D14.A 126.26,73.05 126.26,81.89 C40.- 124.45,83.25 122.89,84.81 119.13,84.81 115.7,88.24 D.4
LD3+  (via drill 0.7)
  Top 0.508: v122.56,58.83 122.56,64.24 118.67,68.12 115.24,68.12 113.18,70.18 113.18,73.84 116.21,76.86 116.21,78.42 116.88,79.1 v117.3,79.1 117.97,78.42 D13.C
  Bottom 0.508: IC13.OUT 118.9,50.98 122.56,54.63 122.56,55.78 C39.2 122.56,56.01 v122.56,58.83 | C37.+ 121.18,82.53 121.18,80.24 121.51,78.64 D13.C | v117.3,79.1 108.84,87.55 108.84,90.3 111.12,92.58 112.5,92.58 114.1,90.98 D.5
LD3-
  Bottom 0.508: D.6 113.18,88.24 113.18,86.84 115.89,84.14 117.47,84.14 C37.- 119.06,74.93 | Q13.C 115.93,64.24 115.93,65.76 119.06,68.9 119.06,74.93 | D13.A 121.68,72.31 119.06,74.93
MA1+
  Top 0.508: C3.2 36.2,40.64 37.46,41.91 39.37,41.91 41.91,44.45 48.58,44.45 49.21,45.09 49.21,54.93 47.31,56.83 47.31,72 D1.C | C3.2 36.2,38.15 36.14,38.1 36.14,38.68 C3.2
  Bottom 0.508: C3.2 36.14,38.63 36.14,37.26 33.17,34.29 IC1.OUT | A.1 43.23,90.75 43.23,89.38 47.57,85.04 47.57,82.07 C1.+ 47.57,81.61 47.12,81.15 47.12,72.59 D1.C
MA1-  (via drill 0.7)
  Top 0.508: v36.14,52.58 36.14,55.32 33.86,57.61 31.29,57.61 29.53,59.37 29.53,61.28 28.58,62.23 27.18,62.23 25.17,64.24 25.17,66.75 29.06,70.64 35,70.64 36.6,72.24 D1.A
  Bottom 0.508: 42.09,83.9 42.09,88.24 A.2 | 42.09,83.9 43.92,82.07 C1.- | v36.14,52.58 39.12,49.61 39.57,49.61 Q1.D | 42.09,83.9 38.43,83.9 37.06,82.53 37.06,72.69 36.83,72.47 D1.A
MA2+  (via drill 0.7)
  Top 0.508: C6.2 31.75,29.21 24.61,29.21 23.65,30.16 23.65,44.93 21.91,46.67 21.91,62.71 v23.49,64.29
  Bottom 0.508: C4.+ 38.89,81.84 39.12,81.61 39.12,75.67 D2.C 39.53,75.56 44.29,70.8 | C6.2 33.66,26.04 IC2.OUT | A.3 40.64,91.28 41.91,92.55 44.45,92.55 49.37,87.63 49.37,72.55 47.47,70.64 44.45,70.64 44.29,70.8 | v23.49,64.29 24.29,64.29 30.64,70.64 44.13,70.64 44.29,70.8
MA2-  (via drill 0.7)  (1 unrouted)
  Top 0.508: D2.A 29.06,75.44 24.26,70.64 17.3,70.64 14.92,68.26 14.92,66.36 13.02,64.45 13.02,55.83 v15.71,53.14
  Bottom 0.508: A.4 39.34,88.24 39.37,88.21 39.37,86.36 38.73,85.72 36.2,83.5 35.88,82.47 C4.- | v15.71,53.14 21.28,47.88 27.23,47.88 30.1,50.75 32.49,50.75 Q2.D | 35,82.07 32.03,82.07 30.43,83.67 29.29,83.67 28.14,82.53 28.14,76.58 29.06,75.67 D2.A
MA3+  (via drill 0.7)
  Top 0.508: 21.39,40.66 C9.2 21.59,44.77 20.95,45.4 | D3.C 31.57,72.24 28.18,72.24 22.96,67.02 17.31,67.02 14.4,63.48 14.4,57.67 17.78,54.29 17.78,48.58 20.95,45.4 | 20.95,45.4 17.46,45.4 14.92,47.94 14.92,51.44 11.43,54.61 11.43,64.77 12.7,66.04 12.7,67.94 11.75,68.9 11.75,70.98 v11.42,71.31
  Bottom 0.508: D3.C 31.57,72.47 31.57,80.24 29.97,81.84 C7.+ | IC3.OUT 18.41,36.78 21.39,39.75 21.39,40.44 21.59,40.48 C9.2 | A.5 38.1,91.44 36.83,92.71 21.59,92.71 14.29,85.41 14.29,74.18 v11.42,71.31
MA3-
  Bottom 0.508: A.6 36.83,88.24 33.17,84.58 28.83,84.58 26.31,82.07 C7.- 26.31,81.61 26.31,77.5 21.28,72.47 D3.A 21.51,72.24 15.71,67.07 15.71,57.98 20.83,53.49 25.63,53.49 Q3.D
MA4+  (via drill 0.7)
  Top 0.508: C12.2 25.4,20.32 10.16,20.32 5.08,25.4 5.08,65.09 6.35,66.36 v9.84,66.36
  Bottom 0.508: C12.2 28.37,17.14 28.37,15.77 25.4,12.8 IC4.OUT | A.7 35.46,90.75 26.09,90.75 17.4,82.07 C10.+ 16.94,81.84 16.71,81.61 16.71,75.67 D4.C 16.51,73.03 v9.84,66.36
MA4-  (via drill 0.7)
  Top 0.508: v23.63,78.44 24.03,78.18 26.54,75.67 D4.A
  Bottom 0.508: A.8 34.09,88.24 27,88.24 20.83,82.07 C10.- 20.83,81.84 20.83,80.92 v23.63,78.44 | Q4.D 19.23,60.81 18.77,60.81 16.62,61.37 16.62,65.38 26.54,74.66 26.54,75.44 D4.A
MB1+
  Top 0.508: D5.C 84.61,72.24 87.9,68.95 87.9,43.87 84.05,40.65 67.32,40.65 65.41,38.73 C15.2
  Bottom 0.508: C15.2 65.41,35.99 62.43,33.02 IC5.OUT | D5.C 84.38,72.47 84.38,81.38 83.92,81.84 C13.+ 83.69,82.07 83.69,83.21 76.15,90.75 68.6,90.75 B.1
MB1-  (via drill 0.7)
  Top 0.508: D5.A 74.32,72.24 76.61,69.95 76.61,61.72 75.53,60.64 74.93,60.64 67.89,53.61 v67.89,49.49
  Bottom 0.508: B.2 67.46,88.24 77.29,88.24 80.26,85.27 80.26,82.07 C13.- 80.26,81.61 80.26,76.58 76.15,72.47 74.32,72.47 D5.A | 64.03,49.38 Q5.D 64.01,49.49 v67.89,49.49
MB2+  (via drill 0.7)
  Top 0.508: v124.38,93.5 124.38,87.55 123.7,86.87 123.7,86.64 123.24,86.18 118.44,86.18 115.24,82.98 115.24,77.27 112.5,74.52 105.41,74.52 105.18,74.75 104.27,74.75 102.9,73.38 102.9,69.24 102.24,68.58 | 102.24,68.58 94.21,68.58 90.32,72.47 86.66,72.47 83.69,75.44 76.84,75.44 D6.C | v120.22,43.23 110.76,43.23 107.63,46.04 107.63,63.18 102.24,68.58
  Bottom 0.508: C18.2 62.66,27.2 62.66,25.83 IC6.OUT 59.69,20.64 61.25,19.07 106.15,19.07 119.58,36.32 v120.22,43.23 | v124.38,93.5 85.06,93.5 84.61,93.04 67.92,93.04 66.78,91.9 66.78,91.67 66.09,90.98 B.3 | C16.+ 75.01,81.84 75.01,77.5 76.84,75.67 D6.C
MB2-  (via drill 0.7)
  Top 0.508: D6.A 66.78,75.44 66.78,72.92 70.17,69.53 70.17,57.78 68.9,56.52 61.91,56.52 60.9,55.5 v60.9,49.71
  Bottom 0.508: B.4 64.95,88.24 71.35,81.84 C16.- 71.35,81.61 71.35,80.24 66.78,75.67 D6.A | v60.9,49.71 57.57,49.71 Q6.D
MB3+  (via drill 0.7)
  Top 0.508: v77.7,94.87 80.67,91.9 80.67,89.38 v76.84,86.18 | v91.01,44.36 102.15,44.36 103.5,45.72 103.5,50.75 v103.4,50.85 | v115.93,69.95 143.81,69.95 v147.57,73.71
  Bottom 0.508: IC7.OUT 47.8,34.29 48.26,34.75 C21.2 48.49,38.86 51.65,42.34 51.85,42.55 75.25,42.55 76.2,41.59 79.06,41.59 81.19,44.36 v91.01,44.36 | v76.84,86.18 73.18,82.53 73.18,75.67 69.98,72.47 D7.C 69.75,72.47 67.23,72.47 64.95,74.75 64.95,76.12 65.86,77.04 65.86,81.84 C19.+ | B.5 63.58,90.98 66.55,93.95 76.15,93.95 v77.7,94.87 121.18,94.87 121.64,95.33 133.53,95.33 150.67,78.18 150.67,74.79 149.54,73.66 147.62,73.66 v147.57,73.71 | v103.4,50.85 103.4,52.63 111.58,60.81 111.58,65.61 v115.93,69.95
MB3-  (via drill 0.7)
  Top 0.508: v52.15,70.41 57.86,70.41 59.69,72.24 D7.A
  Bottom 0.508: B.6 62.43,88.24 62.43,82.07 C19.- 62.66,81.84 62.66,77.72 64.03,76.35 64.03,74.98 61.52,72.47 59.69,72.47 D7.A | v52.15,70.41 47.8,66.06 47.8,59.66 54.2,53.26 54.2,51.66 53.06,50.52 52.83,50.52 51.92,49.61 Q7.D
MB4+  (via drill 0.7)
  Top 0.508: D8.C 62.23,75.41 69.06,68.58 69.06,58.9 68.26,58.1 58.42,58.1 54.93,54.61 v54.93,40.32 | v7.3,60.64 7.3,30.8 12.54,25.56 46.2,25.56 47.94,27.3 C24.2 50.24,29.53 51.12,29.53 51.75,30.16 v51.75,33.34
  Bottom 0.508: IC8.OUT 47.94,25.72 47.94,27.3 C24.2 | B.7 60.96,90.81 56.99,90.81 55.4,89.22 49.21,89.22 44.29,94.14 19.37,94.14 6.83,84.14 6.83,61.12 v7.3,60.64 | C22.+ 57.15,77.15 58.74,75.56 62.15,75.56 D8.C | v51.75,33.34 51.75,36.2 52.71,37.15 52.71,39.05 v54.93,40.32
MB4-  (via drill 0.7)
  Top 0.508: v43.23,53.95 38.66,58.52 31.97,58.52 30.48,60.01 30.48,62.55 29.53,63.5 27.28,63.5 26.09,64.69 26.09,66.29 29.52,69.72 39.24,69.72 45.09,75.56 52.04,75.56 52.37,75.89 52.37,75.8 D8.A 51.92,75.44
  Bottom 0.508: B.8 59.69,88.24 53.52,82.07 C22.- 53.75,81.61 53.75,77.27 52.15,75.67 D8.A | v43.23,53.95 43.23,51.89 45.52,49.61 45.97,49.61 Q8.D
N$1
  Bottom 0.406: 39.8,59.66 39.8,52.35 Q1.G | 40.26,60.12 R1.P$2
  Bottom 0.508: 40.26,60.12 39.8,59.66
N$2
  Bottom 0.508: XOUT.2 3.91,90.98 10.77,90.98 R19.P$2
N$3
  Bottom 0.406: 32.71,53.49 32.71,55.09 37.74,60.12 R2.P$2
  Bottom 0.508: 32.71,53.49 Q2.G
N$4
  Bottom 0.406: R10.P$2 59.69,60.12 62.56,57.25 80.3,57.25 81.86,58.81 Q10.B
N$5
  Bottom 0.406: Q11.B 77.98,55.32 61.98,55.32 57.18,60.12 R11.P$2
N$6
  pour Top (isolate 0.813): 57.15,6.99 99.06,6.99 99.06,0 57.15,0
N$9
  Bottom 0.406: R9.P$2 64.02,58.76 78.42,58.76 81.18,64.69 88.98,64.69 89.85,63.82 89.85,60.33 91.12,59.05 91.51,59.05 Q9.B
N$14
  Bottom 0.406: 35.23,60.12 31.12,56.01 25.86,56.01 Q3.G
  Bottom 0.508: 35.23,60.12 R3.P$2
N$15
  Bottom 0.406: R4.P$2 32.07,60.33 29.84,58.1 27.3,58.1 22.23,63.18 19.44,63.18 Q4.G
N$16
  Bottom 0.406: Q5.G 63.8,52.12 61.98,52.12 56.49,57.61 54.66,57.61 52.15,60.12 R5.P$2
N$18
  Bottom 0.406: R6.P$2 54.93,54.93 56.51,54.93 57.47,53.98 57.47,52.3 Q6.G
N$19
  Bottom 0.406: 51.69,52.35 51.69,53.95 45.52,60.12 R7.P$2
  Bottom 0.508: 51.69,52.35 Q7.G
N$20
  Bottom 0.406: Q8.G 45.97,52.35 45.97,57.15 43,60.12 R8.P$2
N$21
  Bottom 0.406: 70.08,53.49 61.98,53.49 56.95,58.52 56.26,58.52 54.66,60.12
  Bottom 0.508: 70.08,53.49 Q12.B | 54.66,60.12 R12.P$2
N$22
  Bottom 0.406: 118.21,63.55 114.45,58.52 110.9,58.52 106.78,54.41 106.78,38.3 R13.P$2
  Bottom 0.508: 118.21,63.55 118.21,64.01 Q13.B
N$24
  Bottom 0.406: 132.84,66.75 130.56,63.2 121.64,63.2 116.05,57.61 111.35,57.61 108.38,54.63 108.38,36.7 | 108.05,36.37 R14.P$2
  Bottom 0.508: 132.84,66.75 132.84,67.21 Q14.B | 108.05,36.37 108.38,36.7
N$25
  Bottom 0.406: OK1.3 129.54,25.4 130.81,24.13 D16.A 135.89,24.13 137.16,25.4 137.16,35.56 140.97,39.37 143.51,39.37 146.69,42.55 XIN.3
N$26
  Bottom 0.406: OK1.2 D16.C R16.P$1
N$27
  Bottom 0.406: R16.P$2 135.25,20.95 140.02,25.72 140.02,36.51 140.97,37.47 150.56,37.47 XIN.2
N$28  (via drill 0.7)
  Top 0.406: v117.68,30.63 108.05,30.63 R15.P$2
  Bottom 0.406: 147.24,67.21 147.24,63.75 138.42,59.69 138.42,52.77 131.69,46.04 124.14,46.04 121.92,43.81 121.92,33.02 119.53,30.63 v117.68,30.63
  Bottom 0.508: 147.24,67.21 Q15.B
N$29
  Bottom 0.406: OK1.7 R18.P$1
P2
  Top 0.406: B1.2 R9.P$1
P3
  Top 0.406: B1.3 R10.P$1
P4
  Top 0.406: B1.4 R11.P$1
P5
  Top 0.406: B1.5 R12.P$1
P6
  Top 0.406: B1.6 R5.P$1
P7
  Top 0.406: B1.7 R6.P$1
P8
  Top 0.406: B1.8 R7.P$1
P9
  Top 0.406: B1.9 R8.P$1
P10
  Top 0.406: B1.10 R1.P$1
P11
  Top 0.406: B1.11 R2.P$1
P12
  Top 0.406: B1.12 R3.P$1
P13
  Top 0.406: B1.13 R4.P$1
P44
  Top 0.406: 97.87,34.98 100.97,38.08 104.04,38.08
  Top 0.508: 97.87,34.98 B1.44 | 104.04,38.08 R13.P$1
P45
  Top 0.406: B1.45 R14.P$1
P46
  Top 0.406: 97.87,32.23 99.47,30.63 102.77,30.63 R15.P$1
  Top 0.508: 97.87,32.23 B1.46
PRX  (via drill 0.7)  (1 unrouted)
  Top 0.406: B1.0 R17.P$2
  Bottom 0.406: R17.P$2 v67.31,60.33 | OK1.6 v129.54,39.37
PTX  (via drill 0.7)  (1 unrouted)
  Bottom 0.406: v3.81,81.92 3.81,85.86 XOUT.3 | v64.77,62.87 B1.1

### Text on the board
Top: PHOBOS EnsembleTwo v1.1h
tSilk: TUBES | RODS | BARS | DRUMS